# Altium project Bucaneve_single_board.PrjPcb
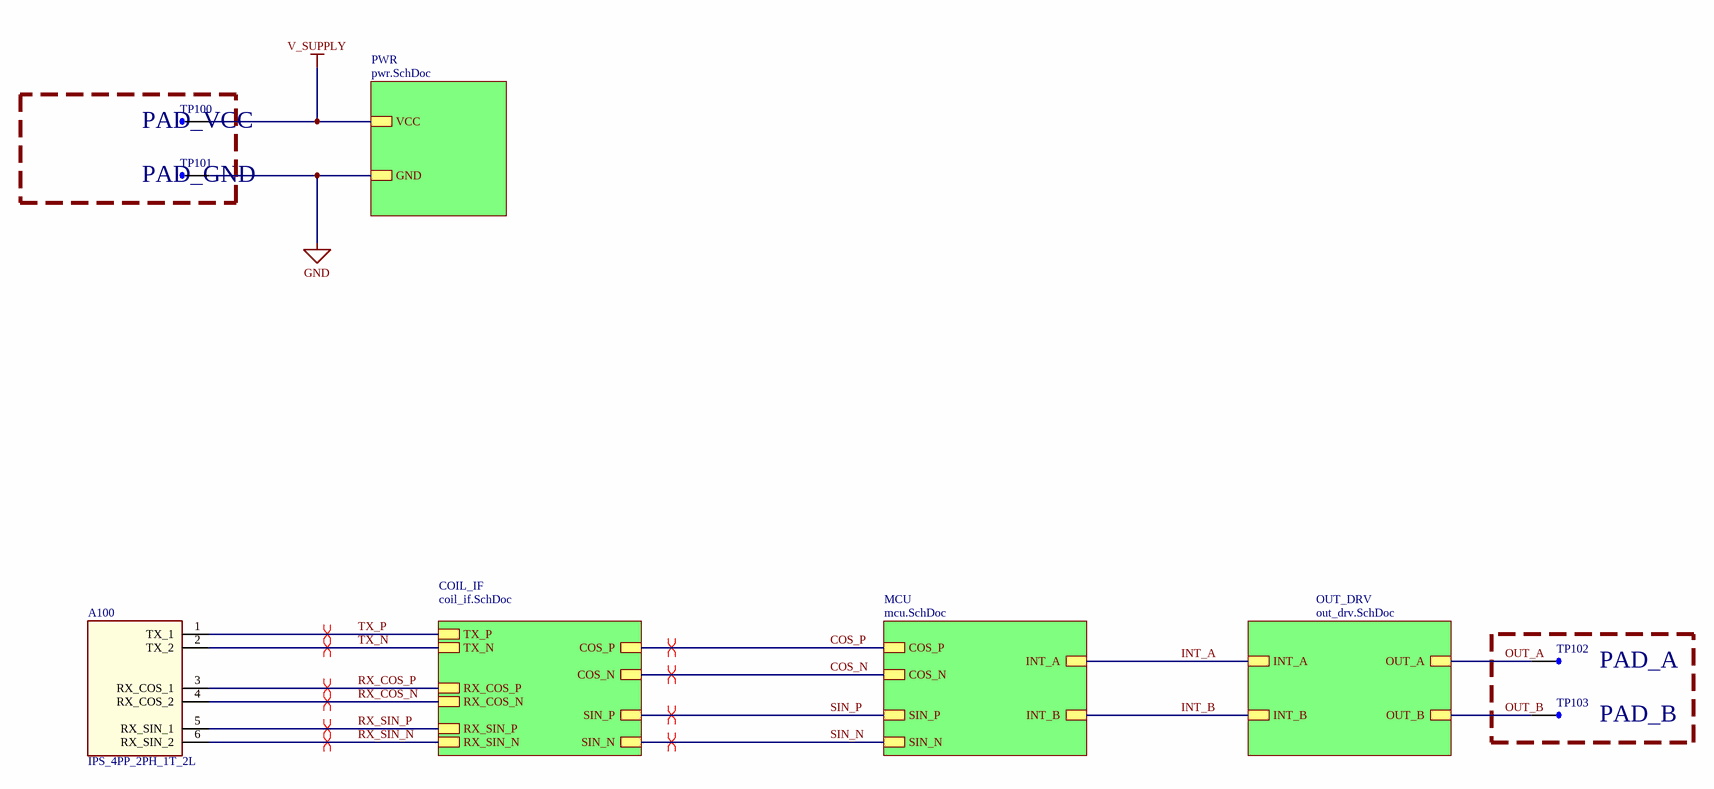
[diagram p0: Bucaneve_single_board.SchDoc]
ProjectRevisionDate: 30/09/2026; ProjectRevision: r0; ProjectCompany: PMP Pro-Mec; ProjectAuthor: S. Vesca; ProjectApproved: --- Not Approved yet ---
5 sheets, 84 parts. Net scope: hierarchical (ports join the sheet entries above them; power ports are global).
Board file: Bucaneve_single_board.PcbDoc
Sheets:
  Bucaneve_single_board.SchDoc
    PWR = pwr.SchDoc
    OUT_DRV = out_drv.SchDoc
    MCU = mcu.SchDoc
    COIL_IF = coil_if.SchDoc

## Sheet Bucaneve_single_board.SchDoc: =ProjectName+'_'+ProjectRevision+'_'+VariantName
size A3; Date: 30/09/2026; ApprovedBy: --- Not Approved yet ---; Author: S. Vesca; CompanyName: PMP Pro-Mec; DocumentNumber: 1; Revision: r0; SheetNumber: 1; SheetTotal: 5

### Parts
A100  IPS_4PP_2PH_1T_2L  [IPS_4PP_2PH_2T_2L4_4TX045_EXT]
TP100  Test Point  [TSTPNT_SMD_RECT_2x6]  (value not drawn)  (no BOM)
TP101  Test Point  [TSTPNT_SMD_RECT_2x6]  (value not drawn)  (no BOM)
TP102  Test Point  [TSTPNT_SMD_RECT_2x6]  (value not drawn)  (no BOM)
TP103  Test Point  [TSTPNT_SMD_RECT_2x6]  (value not drawn)  (no BOM)

### Sub-sheets
COIL_IF = coil_if.SchDoc: COS_P, COS_N, TX_P, TX_N, RX_COS_N, RX_COS_P, SIN_N, SIN_P, RX_SIN_P, RX_SIN_N
MCU = mcu.SchDoc: INT_A, INT_B, COS_P, COS_N, SIN_N, SIN_P
OUT_DRV = out_drv.SchDoc: OUT_A, OUT_B, INT_A, INT_B
PWR = pwr.SchDoc: GND, VCC

### Nets
GND: TP101.1 ; sheet PWR/GND
V_SUPPLY: TP100.1 ; sheet PWR/VCC
COS_N: sheet MCU/COS_N, sheet COIL_IF/COS_N  [project net COS_FILT_N]
COS_P: sheet MCU/COS_P, sheet COIL_IF/COS_P  [project net COS_FILT_P]
INT_A: sheet OUT_DRV/INT_A, sheet MCU/INT_A
INT_B: sheet OUT_DRV/INT_B, sheet MCU/INT_B
OUT_A: TP102.1 ; sheet OUT_DRV/OUT_A
OUT_B: TP103.1 ; sheet OUT_DRV/OUT_B
RX_COS_N: A100.4(RX_COS_2) ; sheet COIL_IF/RX_COS_N
RX_COS_P: A100.3(RX_COS_1) ; sheet COIL_IF/RX_COS_P
RX_SIN_N: A100.6(RX_SIN_2) ; sheet COIL_IF/RX_SIN_N
RX_SIN_P: A100.5(RX_SIN_1) ; sheet COIL_IF/RX_SIN_P
SIN_N: sheet MCU/SIN_N, sheet COIL_IF/SIN_N  [project net SIN_FILT_N]
SIN_P: sheet MCU/SIN_P, sheet COIL_IF/SIN_P  [project net SIN_FILT_P]
TX_N: A100.2(TX_2) ; sheet COIL_IF/TX_N
TX_P: A100.1(TX_1) ; sheet COIL_IF/TX_P

### Layout directives
differential pair: COS_FILT_N, COS_FILT_P, RX_COS_N, RX_COS_P, RX_SIN_N, RX_SIN_P, SIN_FILT_N, SIN_FILT_P, TX_N, TX_P

### Notes on the sheet
- PAD_VCC
- PAD_GND
- PAD_A
- PAD_B
- Proj
- Title:
- Approved:
- Sheet
- File Name:
- Rev:
- Author:
- Date:
- Size:
- A3
- Number:

### Library data of the parts
A100 = IPS_4PP_2PH_2T_2L4_4TX045_EXT: Inductive position sensor, 2 phase, 2 turn, 2Layers 4 Pole pairs; MFG1: PMP; Int Diameter: 39.5mm; Ext Diameter: 63mm; MPN1: IPS_4PP_2PH_2T_2L4_4TX045_EXT; Value: IPS_4PP_2PH_2T_2L
TP100-TP103 = TP_RECT_2x6: Test Point rect 2x5mm; ConnType: TestProbe; MPN1: TP_RECT_2x6; Value: TP_RECT_2x6; Pins: 1; Case/Package: SMD; Orientation: -; Mount: SMD

## Sheet pwr.SchDoc: =ProjectName+'_'+ProjectRevision+'_'+VariantName
size A3; Date: 30/09/2026; ApprovedBy: --- Not Approved yet ---; Author: S. Vesca; CompanyName: PMP Pro-Mec; DocumentNumber: 2; Revision: r0; SheetNumber: 2; SheetTotal: 5
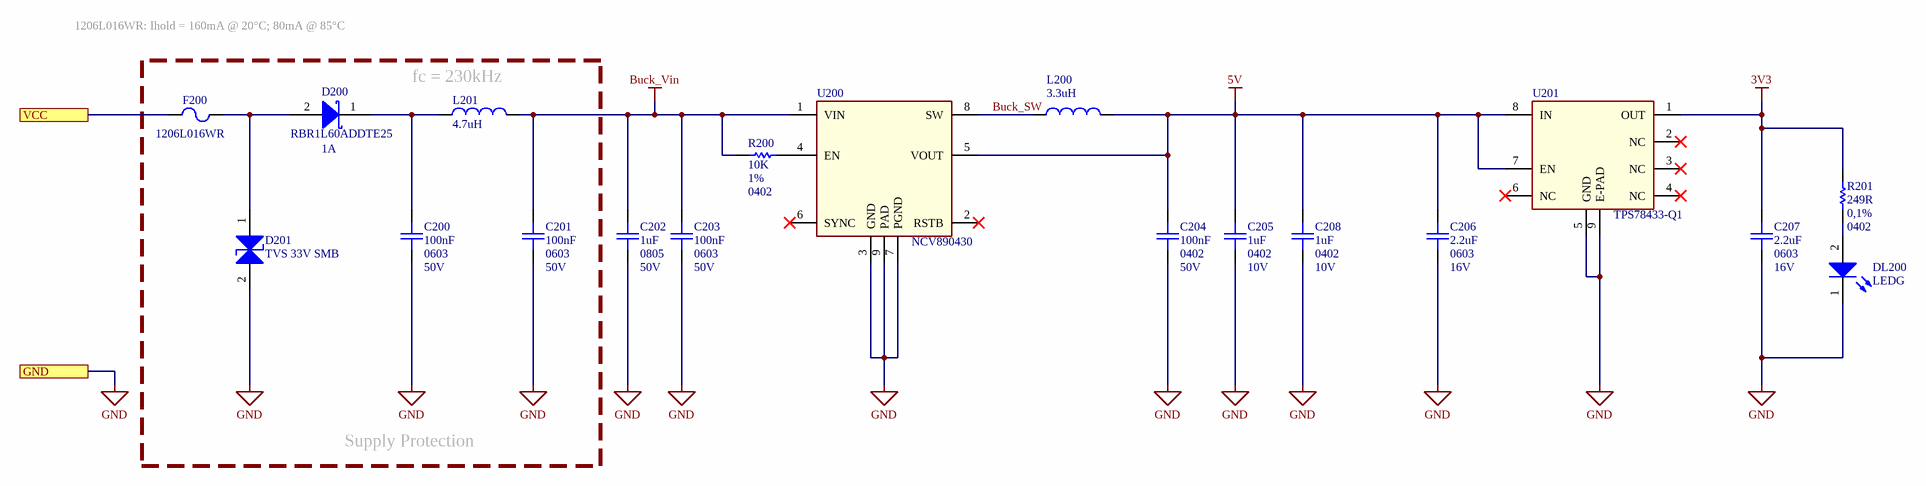
[diagram p1: pwr.SchDoc]

### Parts
C200  Case/Package: 0603  Op Voltage: 50V  [CER0603]  (hidden comment: 100nF)
C201  Case/Package: 0603  Op Voltage: 50V  [CER0603]  (hidden comment: 100nF)
C202  Case/Package: 0805  Op Voltage: 50V  [CER0805]  (hidden comment: 1uF)
C203  Case/Package: 0603  Op Voltage: 50V  [CER0603]  (hidden comment: 100nF)
C204  Case/Package: 0402  Op Voltage: 50V  [CER0402]  (hidden comment: 100nF)
C205  Case/Package: 0402  Op Voltage: 10V  [CER0402]  (hidden comment: 1uF)
C206  Case/Package: 0603  Op Voltage: 16V  [CER0603]  (hidden comment: 2.2uF)
C207  Case/Package: 0603  Op Voltage: 16V  [CER0603]  (hidden comment: 2.2uF)
C208  Case/Package: 0402  Op Voltage: 10V  [CER0402]  (hidden comment: 1uF)
D200  value RBR1L60ADDTE25  If (A): 1A  [DO-214AC_SMA]  (hidden comment: Shottky Rect Diode SMD)
D201  value TVS 33V SMB  [DO-214AA_SMB]  (hidden comment: SMD/PTH TVS Bidirectional Diode)
DL200  value LEDG  [LED SMD 0603]  (hidden comment: Single Color SMD LED)
F200  value 1206L016WR  [FUSC3216X125N]  (hidden comment: Fuse_PTCRes)
L200  value 3.3uH  [WE-MAPI_1212]  (hidden comment: SMD Inductor)
L201  value 4.7uH  [WE-LQ_1210]  (hidden comment: SMD Inductor)
R200  value 10K  Tolerance: 1%  Case/Package: 0402  [Res0402]  (hidden comment: SMD Resistor)
R201  value 249R  Tolerance: 0,1%  Case/Package: 0402  [Res0402]  (hidden comment: SMD Resistor)
U200  value NCV890430  [SON65P300X300X100-9N]  (hidden comment: ONSEMI_NCV890430)
U201  value TPS78433-Q1  [SON65P300X100_HS-9N_NOPAD]  (hidden comment: TI_TPS78533Q_VSON)

### Ports
GND, VCC

### Nets
3V3: C207.1 R201.2 U201.1(OUT)
5V: C204.1 C205.1 C206.1 C208.1 L200.2 U200.5(VOUT) U201.7(EN) U201.8(IN)
Buck_Vin: C201.1 C202.1 C203.1 L201.2 R200.2 U200.1(VIN)
GND: C200.2 C201.2 C202.2 C203.2 C204.2 C205.2 C206.2 C207.2 C208.2 D201.2(K) DL200.1(K) U200.3(GND) U200.7(PGND) U200.9(PAD) U201.5(GND) U201.9(E-PAD) ; port GND
V_SUPPLY: F200.1 ; port VCC
Buck_SW: L200.1 U200.8(SW)
NetC200_1: C200.1 D200.1(K) L201.1
NetD200_2: D200.2(A) D201.1(A) F200.2
NetDL200_2: DL200.2(A) R201.1
NetR200_1: R200.1 U200.4(EN)

Not connected (* = marked no-connect by the designer): U200 2(RSTB)* 6(SYNC)*; U201 2(NC)* 3(NC)* 4(NC)* 6(NC)*

### Notes on the sheet
- 1206L016WR: Ihold = 160mA @ 20°C; 80mA @ 85°C
- (near L201) fc = 230kHz
- Supply Protection
- Proj
- Title:
- Approved:
- Sheet
- File Name:
- Rev:
- Author:
- Date:
- Size:
- A3
- Number:

### Library data of the parts
C200 C201 C203 = GCM188L81H104KA57D: MLCC Automotive, 100nF, 0603, 50V, 10%, X8L; MFG1: MURATA; Min Op# Temp °C: -55; Max Op# temp °C: 150; Qualification: AEC-Q200; MPN1: GCM188L81H104KA57D; Value: 100nF; MFG2: MURATA; MPN2: GCJ188L8EL104KA07; Tolerance: 10%; Dielectric: X8L; Supplier: Mouser; Supplier Part Number: 81-GCM188L81H104KA7D; Supplier URL: https://www.mouser.it/ProductDetail/Murata-Electronics/GCM188L81H104KA57J?qs=yTuLhIm%2Fv1CdnQNNqnCjYQ%3D%3D; Datasheet URL: https://www.mouser.it/datasheet/2/281/1/GCM188L81H104KA57_01A-3144042.pdf; Termination: Soft (GCJ); Technology: Powertrain/Safety for Automotive
C202 = KAM21KR71H105KL: MLCC Automotive, 1uF, 0805, 50V, 10%, X7R; MFG1: KYOCERA-AVX; Min Op# Temp °C: -55; Max Op# temp °C: 125; Qualification: AEC-Q200; MPN1: KAM21KR71H105KL; Value: 1uF; Tolerance: 10%; Dielectric: X7R; Supplier: Mouser; Supplier Part Number: 581-KAM21KR71H105KL; Supplier URL: https://www.mouser.it/ProductDetail/KYOCERA-AVX/08055C105K4T4A?qs=byeeYqUIh0Oh891bMlItEA%3D%3D; Datasheet URL: https://www.mouser.it/datasheet/2/40/AutoMLCC-2952695.pdf; Technology: Powertrain/Safety for Automotive
C204 = GCM155R71H104KE02D: MLCC Automotive, 100nF, 0402, 50V, 10%, X7r; MFG1: MURATA; Min Op# Temp °C: -55; Max Op# temp °C: 125; Qualification: AEC-Q200; MPN1: GCM155R71H104KE02D; Value: 100nF; MFG2: MURATA; MPN2: GCM155R71H104KE37; Tolerance: 10%; Dielectric: X7R; Supplier: Mouser; Supplier Part Number: 81-GCM155R71H104KE2D; Supplier URL: https://www.mouser.it/ProductDetail/Murata-Electronics/GCM155R71H104KE02D?qs=hNud%2FORuBR2sLZsqfoz4Fw%3D%3D; Datasheet URL: https://www.mouser.it/datasheet/2/281/1/GCM155R71H104KE02_01A-3142168.pdf; Technology: Powertrain/Safety for Automotive
C205 C208 = GCM155C71A105ME38D: MLCC Automotive, 1uF, 0402, 10V, 20%, X7S; MFG1: MURATA; Tolerance: 20.00%; Min Op# Temp °C: -55; Max Op# temp °C: 125; Qualification: AEC-Q200; MPN1: GCM155C71A105ME38D; Value: 1uF; Dielectric: X7S; Supplier: Mouser; Supplier Part Number: 81-GCM155C71A105ME8D; Supplier URL: https://www.mouser.it/it/ProductDetail/Murata-Electronics/GCM155C71A105ME38D?qs=sGAEpiMZZMvsSlwiRhF8qiE2qjJvMbsZOkfRw1uqIZmZq%252BZnnVO3gA%3D%3D; Datasheet URL: https://pim.murata.com/asset/pim4/ceramicCapacitorSMD/GCM155C71A105ME38-01A-EN_PDF_CERAMICCAPACITORSMD
C206 C207 = GRT188C71C225KE13D: MLCC Automotive, 2.2uF, 0603, 16V, 10%, X7S; MFG1: MURATA; Min Op# Temp °C: -55; Max Op# temp °C: 125; Qualification: AEC-Q200; MPN1: GRT188C71C225KE13D; Value: 2.2uF; Tolerance: 10%; Dielectric: X7S; Supplier: Mouser; Supplier Part Number: 81-GRT188C71C225KE3D; Supplier URL: https://www.mouser.it/it/ProductDetail/Murata-Electronics/GRT188C71C225KE13D?qs=hd1VzrDQEGhlNcWcmqnE6Q%3D%3D; Datasheet URL: https://www.mouser.it/datasheet/3/76/1/GRT188C71C225KE13_01A.pdf
D200 = RBR1L60ADDTE25: Schottky Rectifier Diode 1A 60V SMA; MFG1: ROHM; Min Op# Temp °C: -55; Max Op# temp °C: 150; Qualification: AEC-Q101; MPN1: RBR1L60ADDTE25; Vreverse: 60V; Case/Package: SMA(DO-214AC); Supplier: Mouser; Supplier Part Number: 755-RBR1L60ADDTE25; Supplier URL: https://www.mouser.it/it/ProductDetail/ROHM-Semiconductor/RBR1L60ADDTE25?qs=4v%252BiZTmLVHHPf04ac7QKmA%3D%3D; Datasheet URL: https://www.rohm.com/datasheet?p=RBR1L60ADD&dist=Mouser&media=referral&source=mouser.com&campaign=Mouser
D201 = SM6T33CAY: TVS Bidir 33V SMB; MFG1: ST; 10/1000us Power: 0.6Kw; 8/20us Power: 4KW; Stand-Off Voltage: 28.2V; Min Op# Temp °C: -55; Max Op# temp °C: 150; Qualification: AEC-Q101; MPN1: SM6T33CAY; Case/Package: SMB/DO-214AA; Type: Bidirectional; Supplier: Mouser; Supplier Part Number: 511-SM6T33CAY; Supplier URL: https://www.mouser.it/ProductDetail/STMicroelectronics/SM6T33CAY?qs=94V4QatVK%252BdOInZlA3gJmA%3D%3D
DL200 = SML-D12P8WT86C: LED standard - SMD Grn 560nm 6.3mcd 2.2 V, 20mA, 0603 AECQ-102; MFG1: ROHM; Vf: 2V @4mA; Max Current@ Tmax: 4mA; Power Diss (mW): 54mW; Min Op# Temp °C: -40; Max Op# temp °C: 100; Qualification: AEC-Q101; MPN1: SML-D12P8WT86C; Case/Package: 0603-Top View; Color: Green 560nm; Supplier: Mouser; Supplier Part Number: 755-SML-D12P8WT86C; Supplier URL: https://www.mouser.it/ProductDetail/ROHM-Semiconductor/SML-D12P8WT86C?qs=HXFqYaX1Q2wFepzn1zWRrg%3D%3D; Datasheet URL: https://fscdn.rohm.com/en/products/databook/datasheet/opto/led/chip_mono/sml-d12p8wt86(c)-e.pdf; Technology: SM
F200 = 1206L016WR: Resettable Fuse PPTC, 160mA Hold, 370mA Trip, 4.5R min, 30V; MFG1: LITTLEFUSE; Max Resistance: 4.5; Min Op# Temp °C: -40; Max Op# temp °C: 125°; Manufacturer: *; PN: *; Voltage: *; Current: *; MPN1: 1206L016WR; Hold Current: 160mA; Case/Package: 1206; Trip Current: 370mA; Supplier: Mouser; Supplier Part Number: 576-1206L016WR; Supplier URL: https://www.mouser.it/it/ProductDetail/Littelfuse/1206L016WR?qs=PWhpLWeW8weybSDHdny44Q%3D%3D; Datasheet URL: https://www.littelfuse.com/assetdocs/resettable-ptcs-1206l-datasheet?assetguid=2B6A1515-D4EE-4C83-8BD4-152B4901B8F5; Technology: SMD
L200 = 74438333033: Power Inductors - SMD WE-MAPI 3,3uH 1.1A DCR=266mOhms AECQ200; MFG1: WE; Fres (MHz): 38; Rated Current (mA): 1.85; Sat Current (mA): 2.05; Rated Voltage: 80; Min Op# Temp °C: -40; Max Op# temp °C: 125; Qualification: AEC-Q200; MPN1: 74438333033; DCR (mR): 266mOhm; Case/Package: 1212; Supplier: Mouser; Supplier Part Number: 710-74438333033; Supplier URL: https://www.mouser.it/it/ProductDetail/Wurth-Elektronik/74438333033?qs=ZB8tH5z5N7YH5nN%252BUBdrEg%3D%3D; Datasheet URL: https://www.we-online.com/components/products/datasheet/74438333033.pdf; Technology: SMD
L201 = 744032004: EMI Filtering Inductor WE-LQ SMT, 4.7uH, 490mA,; MFG1: WE; Rated Current (mA): 490; Sat Current (mA): 1250; DCR (mR): 280mOhm; Min Op# Temp °C: -40; Max Op# temp °C: 125; MPN1: 744032004; Case/Package: 1210; Supplier: Mouser; Supplier Part Number: 710-744032004; Supplier URL: https://www.mouser.it/it/ProductDetail/Wurth-Elektronik/744032004?qs=XJfXErqHgA4qekdNbV2MtQ%3D%3D; Datasheet URL: https://www.we-online.com/components/products/datasheet/744032004.pdf; Technology: SMD
R200 = CRCW040210K0FKED: Thick Film SM Chip Resistors, 10K, 0402, ±1%, 1/10W; MFG1: VISHAY; Power: 63mW; Temp# Coeffiient (PPM/C): 100; Min Op# Temp °C: -55; Max Op# temp °C: 155; Qualification: AEC-Q200; MPN1: CRCW040210K0FKED; Supplier: Mouser; Supplier Part Number: 71-CRCW0402-10K-E3; Supplier URL: https://www.mouser.it/ProductDetail/Vishay-Dale/CRCW040210K0FKED?qs=rlE3Te1NifyN3e8vvxacSw%3D%3D; Technology: Thick Film
R201 = TNPW0402249RBYEP: Thick Film SM Chip Resistors, 249R, 0402, ±0.1%, 10ppm 1/16W; MFG1: VISHAY; Power: 63mW; Temp# Coeffiient (PPM/C): 10; Min Op# Temp °C: -55; Max Op# temp °C: 155; Qualification: AEC-Q200; MPN1: TNPW0402249RBYEP; Supplier: Mouser; Supplier Part Number: 71-TNPW0402249RBYEP; Supplier URL: https://www.mouser.it/ProductDetail/Vishay-Dale/TNPW0402249RBYEP?qs=iLbezkQI%252Bsgmf6IA3nvojA%3D%3D; Technology: Thick Film
U200 = NCV890430MW50TXG: synchronous buck converter; 3.5-37Vin; 5Vout; 600mA; MFG1: OnSemi; Frequency: 2MHz / 1MHz; Max Duty Cycle: 1; Max Input Voltage: 37V; Min Supply Voltage: 3.5V; Min Op# Temp °C: -40°C; Max Op# temp °C: 150°C; Nominal Output Voltage: 5V; Qualification: AEC-Q100; MPN1: NCV890430MW50TXG; Case/Package: DFN-8; Op Voltage: 3.5-37V; Supplier: Mouser; Supplier Part Number: 863-NCV890430MW50TXG; Supplier URL: https://www.mouser.it/it/ProductDetail/onsemi/NCV890430MW50TXG?qs=OycAS1CGnlh8h8gdwAjytg%3D%3D; Datasheet URL: https://www.onsemi.com/download/data-sheet/pdf/ncv890430-d.pdf; ComponentType: DCDC converter; Max Ouput Current: 600mA; Max Supply Voltage (DC): 37V; Min Input Voltage: 3.5V; Switching Frequency: 2MHz / 1MHz
U201 = TPS78433QWDRBRQ1: TPS784-Q1 Automotive, 3.3V, 300mA, High-PSRR LDO; MFG1: TI; Vin Min (V): 1.7; Vin Max (V): 6V; Out Voltage Accuracy: 0.5%; Dropout @ Imax (V): 0.08; Quiescent cuttent(uA): 25; Min Op# Temp °C: -40; Max Op# temp °C: 150; Qualification: AEC-Q100; MPN1: TPS78433QWDRBRQ1; Case/Package: WSON-8 3x3; Imax (mA): 300mA; Output Type: 3.3V; Supplier: Mouser; Supplier Part Number: 595-TPS78433QWDRBRQ1; Supplier URL: https://www.mouser.it/ProductDetail/Texas-Instruments/TPS78433QWDRBRQ1?qs=iLbezkQI%252BsgJRXPFYNHjvQ%3D%3D; Datasheet URL: https://www.ti.com/lit/gpn/tps784-q1

## Sheet out_drv.SchDoc: =ProjectName+'_'+ProjectRevision+'_'+VariantName
size A3; Date: 30/09/2026; ApprovedBy: --- Not Approved yet ---; Author: S. Vesca; CompanyName: PMP Pro-Mec; DocumentNumber: 5; Revision: r0; SheetNumber: 5; SheetTotal: 5
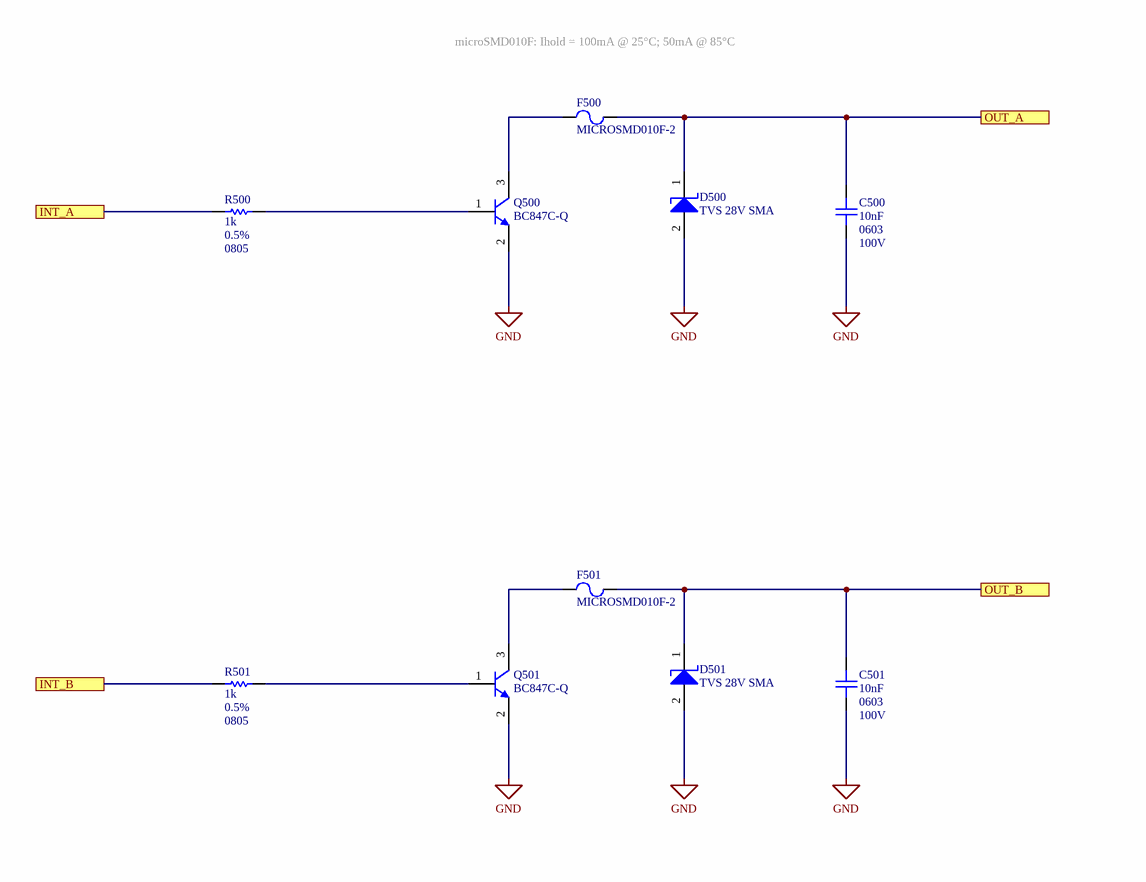
[diagram p2: out_drv.SchDoc, left]

### Parts
C500  Case/Package: 0603  Op Voltage: 100V  [CER0603]  (hidden comment: 10nF)
C501  Case/Package: 0603  Op Voltage: 100V  [CER0603]  (hidden comment: 10nF)
D500  value TVS 28V SMA  [DO-214AC_SMA]  (hidden comment: SMD/PTH TVS Unidirectional Diode)
D501  value TVS 28V SMA  [DO-214AC_SMA]  (hidden comment: SMD/PTH TVS Unidirectional Diode)
F500  value MICROSMD010F-2  [PTCC3226X08N]  (hidden comment: Fuse_PTCRes)
F501  value MICROSMD010F-2  [PTCC3226X08N]  (hidden comment: Fuse_PTCRes)
Q500  value BC847C-Q  [SOT95P230X110-3N]  (hidden comment: NPN Transistor SMD)
Q501  value BC847C-Q  [SOT95P230X110-3N]  (hidden comment: NPN Transistor SMD)
R500  value 1k  Tolerance: 0.5%  Case/Package: 0805  [Res0603]  (hidden comment: SMD Resistor)
R501  value 1k  Tolerance: 0.5%  Case/Package: 0805  [Res0603]  (hidden comment: SMD Resistor)

### Ports
INT_A, INT_B, OUT_A, OUT_B

### Nets
GND: C500.2 C501.2 D500.2(A) D501.2(A) Q500.2(E) Q501.2(E)
INT_A: R500.1 ; port INT_A
INT_B: R501.1 ; port INT_B
OUT_A: C500.1 D500.1(K) F500.2 ; port OUT_A
OUT_B: C501.1 D501.1(K) F501.2 ; port OUT_B
NetF500_1: F500.1 Q500.3(C)
NetF501_1: F501.1 Q501.3(C)
NetQ500_1: Q500.1(B) R500.2
NetQ501_1: Q501.1(B) R501.2

### Notes on the sheet
- microSMD010F: Ihold = 100mA @ 25°C; 50mA @ 85°C
- Proj
- Title:
- Approved:
- Sheet
- File Name:
- Rev:
- Author:
- Date:
- Size:
- A3
- Number:

### Library data of the parts
C500 C501 = GCM188R72A103KA37: MLCC Automotive, 10nF, 0603, 100V, 10%, X7R; MFG1: MURATA; Min Op# Temp °C: -55; Max Op# temp °C: 125; Qualification: AEC-Q200; MPN1: GCM188R72A103KA37; Value: 10nF; Tolerance: 10%; Dielectric: X7R; Supplier: Mouser; Supplier Part Number: 81-GCM188R72A103KA7D; Supplier URL: https://www.mouser.it/ProductDetail/Murata-Electronics/GCM188R72A103KA37D?qs=aEuGZpxfbxXMjTExujWHsg%3D%3D; Datasheet URL: https://www.mouser.it/datasheet/2/281/1/GCM188R72A103KA37_01C-3144519.pdf; Technology: Powertrain/Safety for Automotive
D500 D501 = SMA6T28AY: TVS Uniir 28V SMA; MFG1: ST; 10/1000us Power: 0.6Kw; 8/20us Power: 4KW; Stand-Off Voltage: 24V; Min Op# Temp °C: -55; Max Op# temp °C: 150; Qualification: AEC-Q101; MPN1: SMA6T28AY; Case/Package: SMA/DO-214AC; Type: Unidirectional; Supplier: Mouser; Supplier Part Number: 511-SMA6T28AY; Supplier URL: https://www.mouser.it/ProductDetail/STMicroelectronics/SMAJ30A-TR?qs=zr%2F4QzOm779pW41kykOibw%3D%3D; Datasheet URL: https://www.mouser.it/datasheet/2/389/sma6ty-1850088.pdf
F500 F501 = MICROSMD010F-2: Resettable Fuse PPTC, 100mA Hold, 250mA Trip, 2.1R min, 30V; MFG1: LITTLEFUSE; Max Resistance: 2.1; Min Op# Temp °C: -40; Max Op# temp °C: 85°; Manufacturer: *; PN: *; Voltage: *; Current: *; MPN1: MICROSMD010F-2; Hold Current: 100mA; Case/Package: 1210; Trip Current: 250mA; Supplier: Mouser; Supplier Part Number: 650-MICROSMD010F-2; Supplier URL: https://www.mouser.it/it/ProductDetail/Littelfuse/MICROSMD010F-2?qs=RMiEzKrVl1c3GmCbTUJbRQ%3D%3D; Datasheet URL: https://www.littelfuse.com/assetdocs/littelfuse-ptc-microsmd-datasheet?assetguid=9831a125-bc6a-4727-872e-aa92d8395030; Technology: SMD
Q500 Q501 = NEXPERIA: NPN general purpose transistors; MPN1: BC847C-QR; Vce Max (V): 45; Ic (mA): 100; Hfe (min): 520; Power Diss (mW): 250; Min Op# Temp °C: -65; Max Op# temp °C: 150; Qualification: AEC-Q101; Manufacturer: *; PN: *; MFG1: NEXPERIA; MFG2: Diodes; MPN2: BC847C-Q; Case/Package: SOT23-3; Type: NPN; Supplier: Mouser; Supplier Part Number: 771-BC847C-QR; Supplier URL: https://www.mouser.it/ProductDetail/Nexperia/BC847C-QR?qs=e8oIoAS2J1RqA3Lgar2wrA%3D%3D; Manufacturer URL: https://www.nexperia.com/search?q=BC847C-Q&searchCategory=
R500 R501 = ERJ-UP6D1001V: Thick Film SM Chip Resistors, 1K, 0805, ±0.5%, 1/2W; MFG1: PANASONIC; Power: 500mW; Temp# Coeffiient (PPM/C): 100; Min Op# Temp °C: -55; Max Op# temp °C: 155; Qualification: AEC-Q200; MPN1: ERJ-UP6D1001V; Supplier: Mouser; Supplier Part Number: 667-ERJ-UP6D1001V; Supplier URL: https://www.mouser.it/ProductDetail/Panasonic/ERJ-UP6D1001V?qs=sGAEpiMZZMvdGkrng054t2cqbZCzJY7NErLgAwiDoTXwln0CjOTO8w%3D%3D; Datasheet URL: https://www.mouser.com/catalog/specsheets/Panasonic_03-31-2024_Resistor_Anti-Sulfur(ERJ-UP6D-Series).pdf?_gl=1*1e8nwi8*_gcl_aw*R0NMLjE3Njc5NTQ2NTkuQ2p3S0NBaUE2NExMQmhCaEVpd0EtUHhndXhkNEYtbVB4TUc1OThEMlhWWVZvVEZGVXVGM1djYmUtdlk1a3VMZFRfZGNHclBMelhFSjRSb0NH; Technology: Thick Film

## Sheet mcu.SchDoc: =ProjectName+'_'+ProjectRevision+'_'+VariantName
size A3; Date: 30/09/2026; ApprovedBy: --- Not Approved yet ---; Author: S. Vesca; CompanyName: PMP Pro-Mec; DocumentNumber: 4; Revision: r0; SheetNumber: 4; SheetTotal: 5
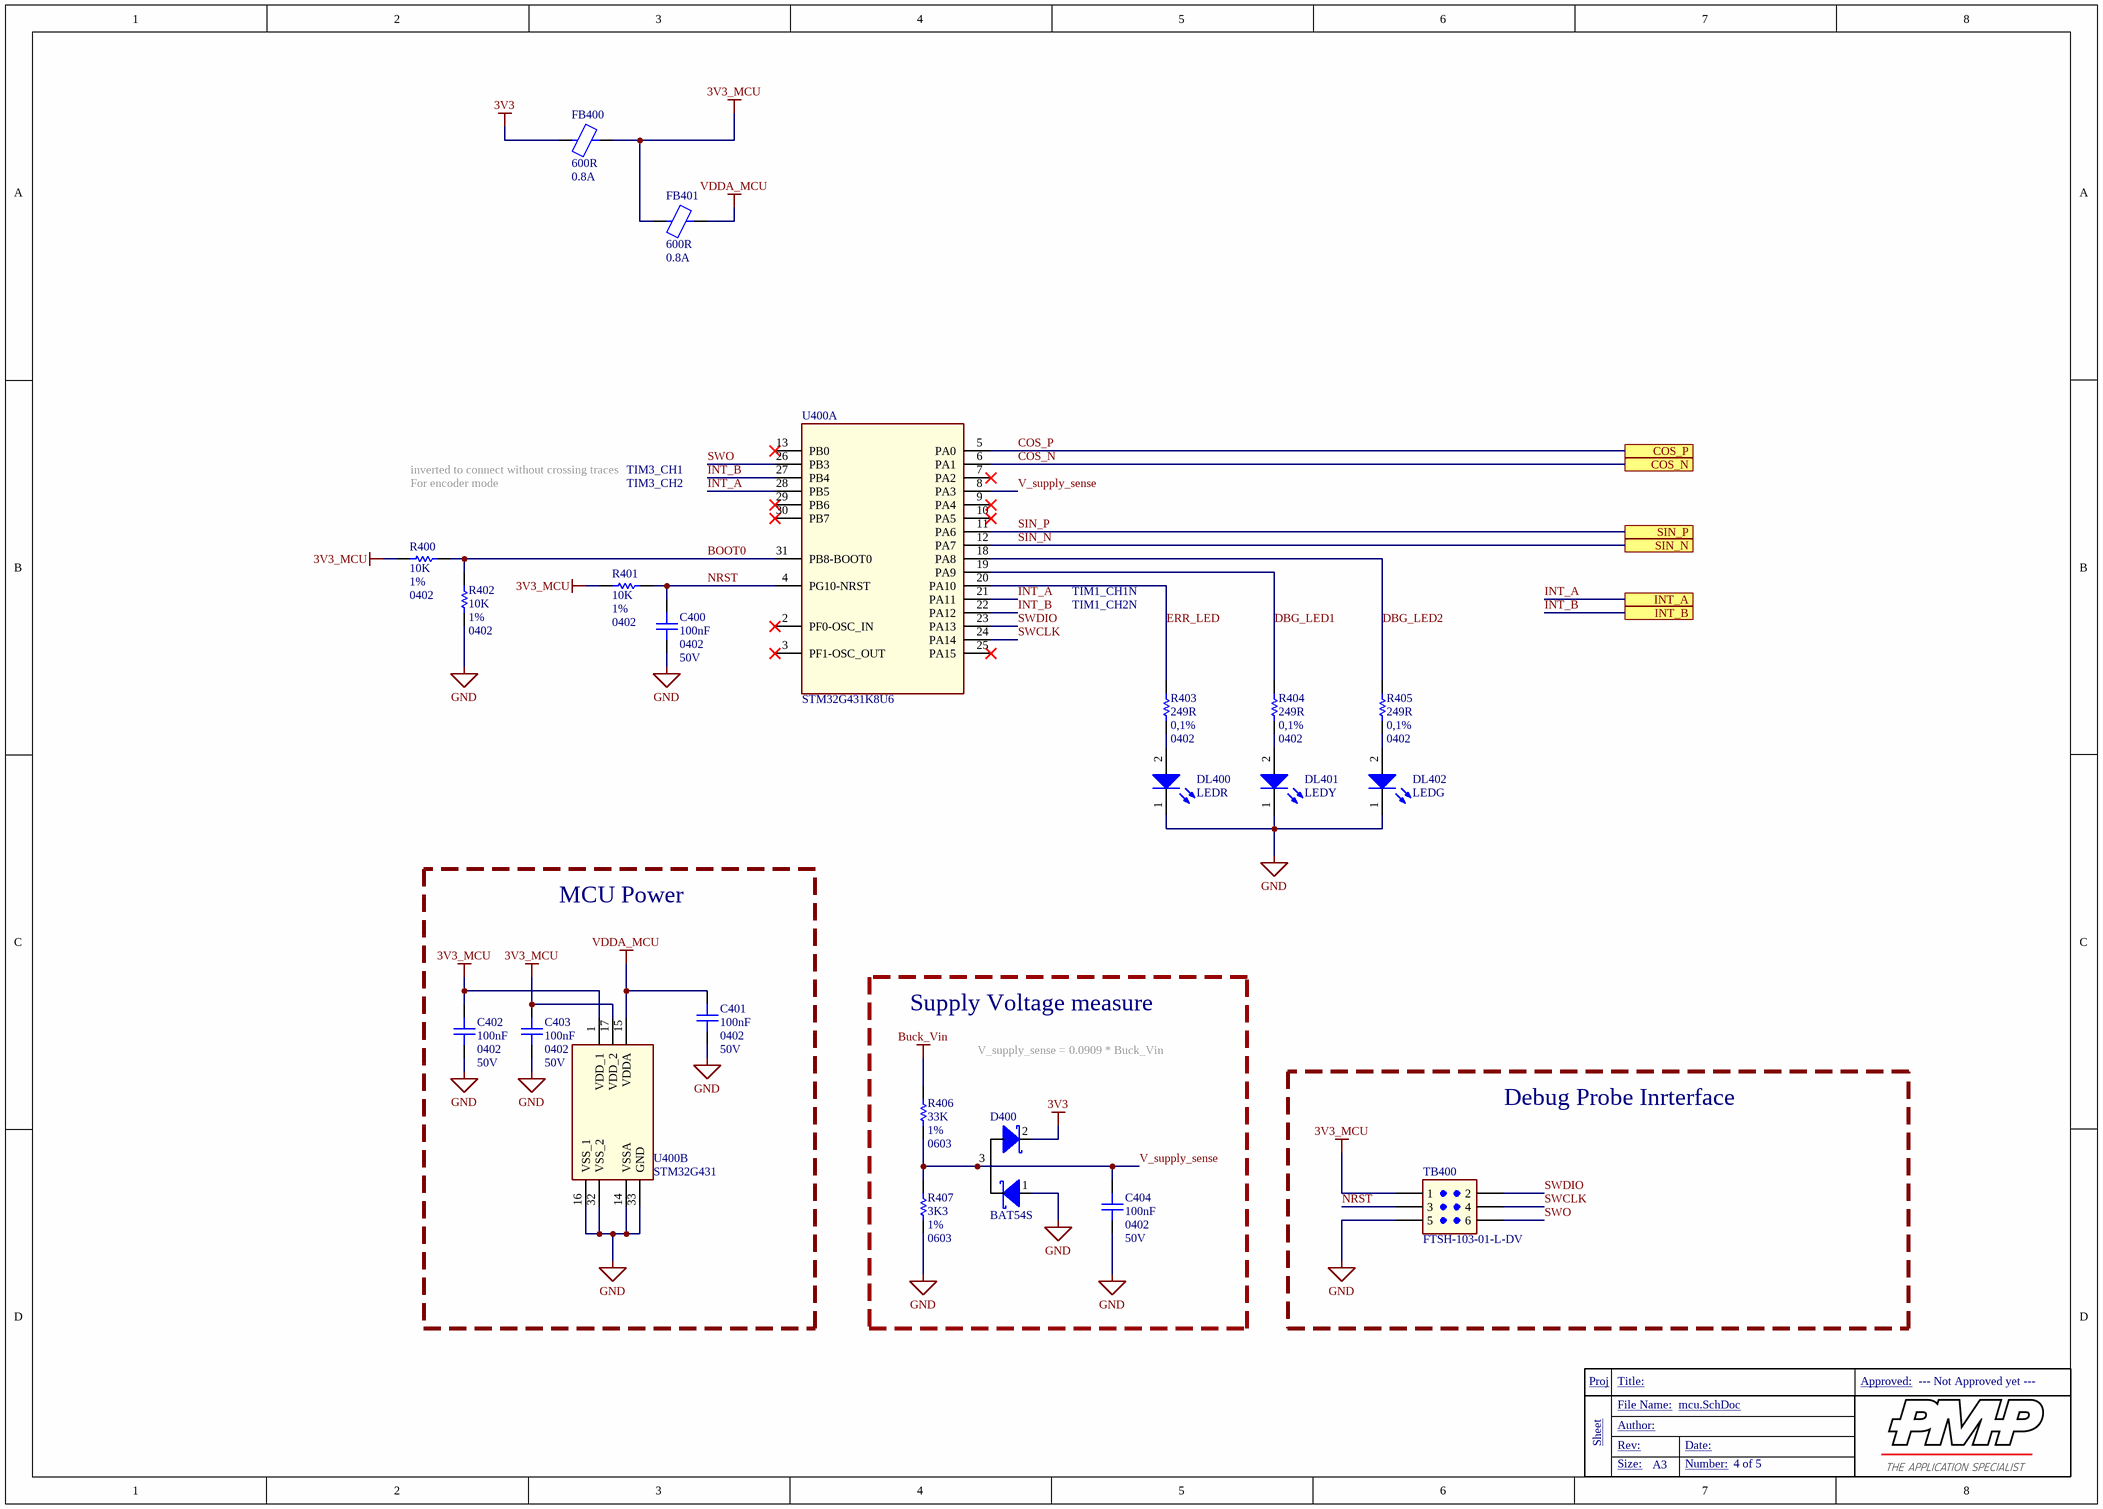
[diagram p3: mcu.SchDoc]

### Parts
C400  Case/Package: 0402  Op Voltage: 50V  [CER0402]  (hidden comment: 100nF)
C401  Case/Package: 0402  Op Voltage: 50V  [CER0402]  (hidden comment: 100nF)
C402  Case/Package: 0402  Op Voltage: 50V  [CER0402]  (hidden comment: 100nF)
C403  Case/Package: 0402  Op Voltage: 50V  [CER0402]  (hidden comment: 100nF)
C404  Case/Package: 0402  Op Voltage: 50V  [CER0402]  (hidden comment: 100nF)
D400  value BAT54S  [SOT95P230X110-3N]  (hidden comment: Double Schottky Diode, SOT23-3 series)
DL400  value LEDR  [LED SMD 0603]  (hidden comment: Single Color SMD LED)
DL401  value LEDY  [LED_PLCC-4]  (hidden comment: Single Color SMD LED)
DL402  value LEDG  [LED SMD 0603]  (hidden comment: Single Color SMD LED)
FB400  Impedence @100MHz: 600R  Rated Current @85°C: 0.8A  [FEB0603]
FB401  Impedence @100MHz: 600R  Rated Current @85°C: 0.8A  [FEB0603]
R400  value 10K  Tolerance: 1%  Case/Package: 0402  [Res0402]  (hidden comment: SMD Resistor)
R401  value 10K  Tolerance: 1%  Case/Package: 0402  [Res0402]  (hidden comment: SMD Resistor)
R402  value 10K  Tolerance: 1%  Case/Package: 0402  [Res0402]  (hidden comment: SMD Resistor)
R403  value 249R  Tolerance: 0,1%  Case/Package: 0402  [Res0402]  (hidden comment: SMD Resistor)
R404  value 249R  Tolerance: 0,1%  Case/Package: 0402  [Res0402]  (hidden comment: SMD Resistor)
R405  value 249R  Tolerance: 0,1%  Case/Package: 0402  [Res0402]  (hidden comment: SMD Resistor)
R406  value 33K  Tolerance: 1%  Case/Package: 0603  [Res0603]  (hidden comment: SMD Resistor)
R407  value 3K3  Tolerance: 1%  Case/Package: 0603  [Res0603]  (hidden comment: SMD Resistor)
TB400  value FTSH-103-01-L-DV  [SAMTEC_FTSH-103_3x2_SMD]  (hidden comment: TC2030_NL)
U400  STM32G431K8U6  [QFN50P500X500X60-NOPAD]  (parts A,B of 2)

### Blocks framed on the sheet
MCU Power: C401-C403 U400
Supply Voltage measure: C404 D400 R406 R407
Debug Probe Inrterface: TB400

### Ports
COS_N, COS_P, INT_A, INT_B, SIN_N, SIN_P

### Nets
3V3: D400.2(K2) FB400.1
3V3_MCU: C402.1 C403.1 FB400.2 FB401.1 R400.2 R401.2 TB400.1 U400.1(VDD_1) U400.17(VDD_2)
Buck_Vin: R406.2
GND: C400.2 C401.2 C402.2 C403.2 C404.2 D400.1(A1) DL400.1(K) DL401.1(K) DL402.1(K) R402.1 R407.1 TB400.5 U400.14(VSSA) U400.16(VSS_1) U400.32(VSS_2) U400.33(GND)
VDDA_MCU: C401.1 FB401.2 U400.15(VDDA)
BOOT0: R400.1 R402.2 U400.31(PB8-BOOT0)
COS_N: U400.6(PA1) ; port COS_N  [project net COS_FILT_N]
COS_P: U400.5(PA0) ; port COS_P  [project net COS_FILT_P]
DBG_LED1: R404.2 U400.19(PA9)
DBG_LED2: R405.2 U400.18(PA8)
ERR_LED: R403.2 U400.20(PA10)
INT_A: U400.21(PA11) U400.28(PB5) ; port INT_A
INT_B: U400.22(PA12) U400.27(PB4) ; port INT_B
NRST: C400.1 R401.1 TB400.3 U400.4(PG10-NRST)
SIN_N: U400.12(PA7) ; port SIN_N  [project net SIN_FILT_N]
SIN_P: U400.11(PA6) ; port SIN_P  [project net SIN_FILT_P]
SWCLK: TB400.4 U400.24(PA14)
SWDIO: TB400.2 U400.23(PA13)
SWO: TB400.6 U400.26(PB3)
V_supply_sense: C404.1 D400.3(C) R406.1 R407.2 U400.8(PA3)
NetDL400_2: DL400.2(A) R403.1
NetDL401_2: DL401.2(A) R404.1
NetDL402_2: DL402.2(A) R405.1

Not connected (* = marked no-connect by the designer): U400 2(PF0-OSC_IN)* 3(PF1-OSC_OUT)* 7(PA2)* 9(PA4)* 10(PA5)* 13(PB0)* 25(PA15)* 29(PB6)* 30(PB7)*

### Notes on the sheet
- inverted to connect without crossing traces
- For encoder mode
- TIM3_CH1
- TIM3_CH2
- TIM1_CH1N
- TIM1_CH2N
- V_supply_sense = 0.0909 * Buck_Vin
- Proj
- Title:
- Approved:
- Sheet
- File Name:
- Rev:
- Author:
- Date:
- Size:
- A3
- Number:

### Library data of the parts
C400-C404 = GCM155R71H104KE02D: as C204 on sheet pwr; MPN1: GCM155R71H104KE02D; Value: 100nF; MFG2: MURATA; MPN2: GCM155R71H104KE37; Tolerance: 10%; Dielectric: X7R; Supplier: Mouser; Supplier Part Number: 81-GCM155R71H104KE2D; Supplier URL: https://www.mouser.it/ProductDetail/Murata-Electronics/GCM155R71H104KE02D?qs=hNud%2FORuBR2sLZsqfoz4Fw%3D%3D; Datasheet URL: https://www.mouser.it/datasheet/2/281/1/GCM155R71H104KE02_01A-3142168.pdf; Technology: Powertrain/Safety for Automotive
D400 = BAT54S: Dual Schottky Diode,  Dual Series, SOT23, 0.2A, 30V; MFG1: NEXPERIA; If (A): 0.2; Type: Dual Series A1K2C; MPN1: BAT54S; MFG2: OnSemi; MPN2: BAT54SLT1G; Vreverse: 30V; Case/Package: SOT323-3 (SC70)
DL400 = SML-D12U8WT86C: LED standard - SMD Red 620nm 63mcd 2.2 V, 20mA, 0603 AECQ-102; MFG1: ROHM; Vf: 2V @4mA; Max Current@ Tmax: 4mA; Power Diss (mW): 54mW; Min Op# Temp °C: -40; Max Op# temp °C: 100; Qualification: AEC-Q101; MPN1: SML-D12U8WT86C; Case/Package: 0603-Top View; Color: red 620nm; Supplier: Mouser; Supplier Part Number: 755-SML-D12U8WT86C; Supplier URL: https://www.mouser.it/ProductDetail/ROHM-Semiconductor/SML-D12U8WT86C?qs=HXFqYaX1Q2wNcb%2FPJz96zg%3D%3D; Datasheet URL: https://fscdn.rohm.com/en/products/databook/datasheet/opto/led/chip_mono/sml-d12u8wt86(c)-e.pdf; Technology: SM
DL401 = LY E63F-EAGA-36-1-50-R33: LED monocolore Yellow Power TOPLED; MFG1: OSRAM; Vf: 1.85V@4mA; Max Current@ Tmax: 50mA; Min Op# Temp °C: -40; Max Op# temp °C: 100; Qualification: AEC-Q102; MPN1: LY E63F-EAGA-36-1-50-R33; Case/Package: PLCC4 3x3.4 h3.8mm; Color: Yellow 590nm; Supplier: Mouser; Supplier Part Number: 720-LYE63FA5935; Supplier URL: https://www.mouser.it/it/ProductDetail/ams-OSRAM/LY-E63F-EAGA-36-1?qs=vLWxofP3U2ym8HO6HoqADg%3D%3D; Datasheet URL: https://dammedia.osram.info/media/resource/hires/osram-dam-7071545/LY%20E63F_EN.pdf; Technology: SM
DL402 = SML-D12P8WT86C: as DL200 on sheet pwr; MPN1: SML-D12P8WT86C; Case/Package: 0603-Top View; Color: Green 560nm; Supplier: Mouser; Supplier Part Number: 755-SML-D12P8WT86C; Supplier URL: https://www.mouser.it/ProductDetail/ROHM-Semiconductor/SML-D12P8WT86C?qs=HXFqYaX1Q2wFepzn1zWRrg%3D%3D; Datasheet URL: https://fscdn.rohm.com/en/products/databook/datasheet/opto/led/chip_mono/sml-d12p8wt86(c)-e.pdf; Technology: SM
FB400 FB401 = BLM18HE601SH1D: SMD EMI Suppression Ferrite Bead 600R, 0603, For DC Power; MFG1: MURATA; Rated Current @125°C: 0.6A; DCR (mR): 125; Min Op# Temp °C: -55; MPN1: BLM18HE601SH1D; Impedence @1GHz: 600R; Case/Package: 0603; Supplier: Mouser; Supplier Part Number: 81-BLM18HE601SH1D; Supplier URL: https://www.mouser.it/ProductDetail/Murata-Electronics/BLM18HE601SH1D?qs=d0WKAl%252BL4KZJDOgHon8ecQ%3D%3D; Datasheet URL: https://www.murata.com/products/productdata/8796199452702/QNFA9104.pdf?1539737628000; Max Op# temp °C: 125; Technology: AEC-Q200
R400-R402 = CRCW040210K0FKED: as R200 on sheet pwr; MPN1: CRCW040210K0FKED; Supplier: Mouser; Supplier Part Number: 71-CRCW0402-10K-E3; Supplier URL: https://www.mouser.it/ProductDetail/Vishay-Dale/CRCW040210K0FKED?qs=rlE3Te1NifyN3e8vvxacSw%3D%3D; Technology: Thick Film
R403-R405 = TNPW0402249RBYEP: as R201 on sheet pwr; MPN1: TNPW0402249RBYEP; Supplier: Mouser; Supplier Part Number: 71-TNPW0402249RBYEP; Supplier URL: https://www.mouser.it/ProductDetail/Vishay-Dale/TNPW0402249RBYEP?qs=iLbezkQI%252Bsgmf6IA3nvojA%3D%3D; Technology: Thick Film
R406 = CRCW060333K0FKEA: Thick Film SM Chip Resistors, 33K, 0603, ±1%, 1/10W; MFG1: VISHAY; Power: 100mW; Temp# Coeffiient (PPM/C): 100; Min Op# Temp °C: -55; Max Op# temp °C: 155; Qualification: AEC-Q200; MPN1: CRCW060333K0FKEA; Supplier: Mouser; Supplier Part Number: 71-CRCW0603-33K-E3; Supplier URL: https://www.mouser.it/ProductDetail/Vishay-Dale/CRCW060333K0FKEA?qs=lRdAfIXKPc%2FlOd6gcmC8oQ%3D%3D; Technology: Thick Film
R407 = CRCW06033K30FKEA: Thick Film SM Chip Resistors, 3K3, 0603, ±1%, 1/10W; MFG1: VISHAY; Power: 100mW; Temp# Coeffiient (PPM/C): 100; Min Op# Temp °C: -55; Max Op# temp °C: 155; Qualification: AEC-Q200; MPN1: CRCW06033K30FKEA; Supplier: Mouser; Supplier Part Number: 71-CRCW0603-3.3K-E3; Supplier URL: https://www.mouser.it/ProductDetail/Vishay-Dale/CRCW06033K30FKEA?qs=1ghF3ZI8kS8fRqapjAj84Q%3D%3D&gad_source=1&gclid=EAIaIQobChMI4J_M0IWohAMVrUNBAh1qNACkEAAYBCAAEgIV-vD_BwE; Technology: Thick Film
TB400 = FTSH-103-01-L-DV: Samtech FTSH Header, 6pin (3x2), pitch 1.27mm, for Arm Jtag; MFG1: Samtec; Pitch: 1.27; Min Op# Temp °C: -55; Max Op# temp °C: 125; MPN1: FTSH-103-01-L-DV; Pins: 6; Case/Package: SMD-6; Orientation: Vertical; Mount: SMD; Supplier: Mouser; Supplier Part Number: 200-FTSH10301LDV; Supplier URL: https://www.mouser.it/it/ProductDetail/Samtec/FTSH-103-01-L-DV?qs=WqbWUrltBn0517uOVN%2FZKw%3D%3D; Datasheet URL: https://www.mouser.it/datasheet/3/85/1/ftsh_smt.pdf
U400 = STM32G431K8U6: MCU  Arm Cortex-M4 MCU 170 MHz -64 KB Flash; Manufacturer_Name: STMicroelectronics; Geometry.Height: 0.6mm; Mouser Part Number: 511-STM32G431K8U6; Mouser Price/Stock: https://www.mouser.co.uk/ProductDetail/STMicroelectronics/STM32G431K8U6?qs=sPbYRqrBIVmxpguskjGNNg%3D%3D; Manufacturer_Part_Number: STM32G431K8U6; Datasheet Link: https://www.st.com/resource/en/datasheet/stm32g431c6.pdf; MPN1: STM32G431K8U6; Value: STM32G431; MFG1: STMicroelectronics; Case/Package: QFN32

## Sheet coil_if.SchDoc: =ProjectName+'_'+ProjectRevision+'_'+VariantName
size A3; Date: 30/09/2026; ApprovedBy: --- Not Approved yet ---; Author: S. Vesca; CompanyName: PMP Pro-Mec; DocumentNumber: 3; Revision: r0; SheetNumber: 3; SheetTotal: 5
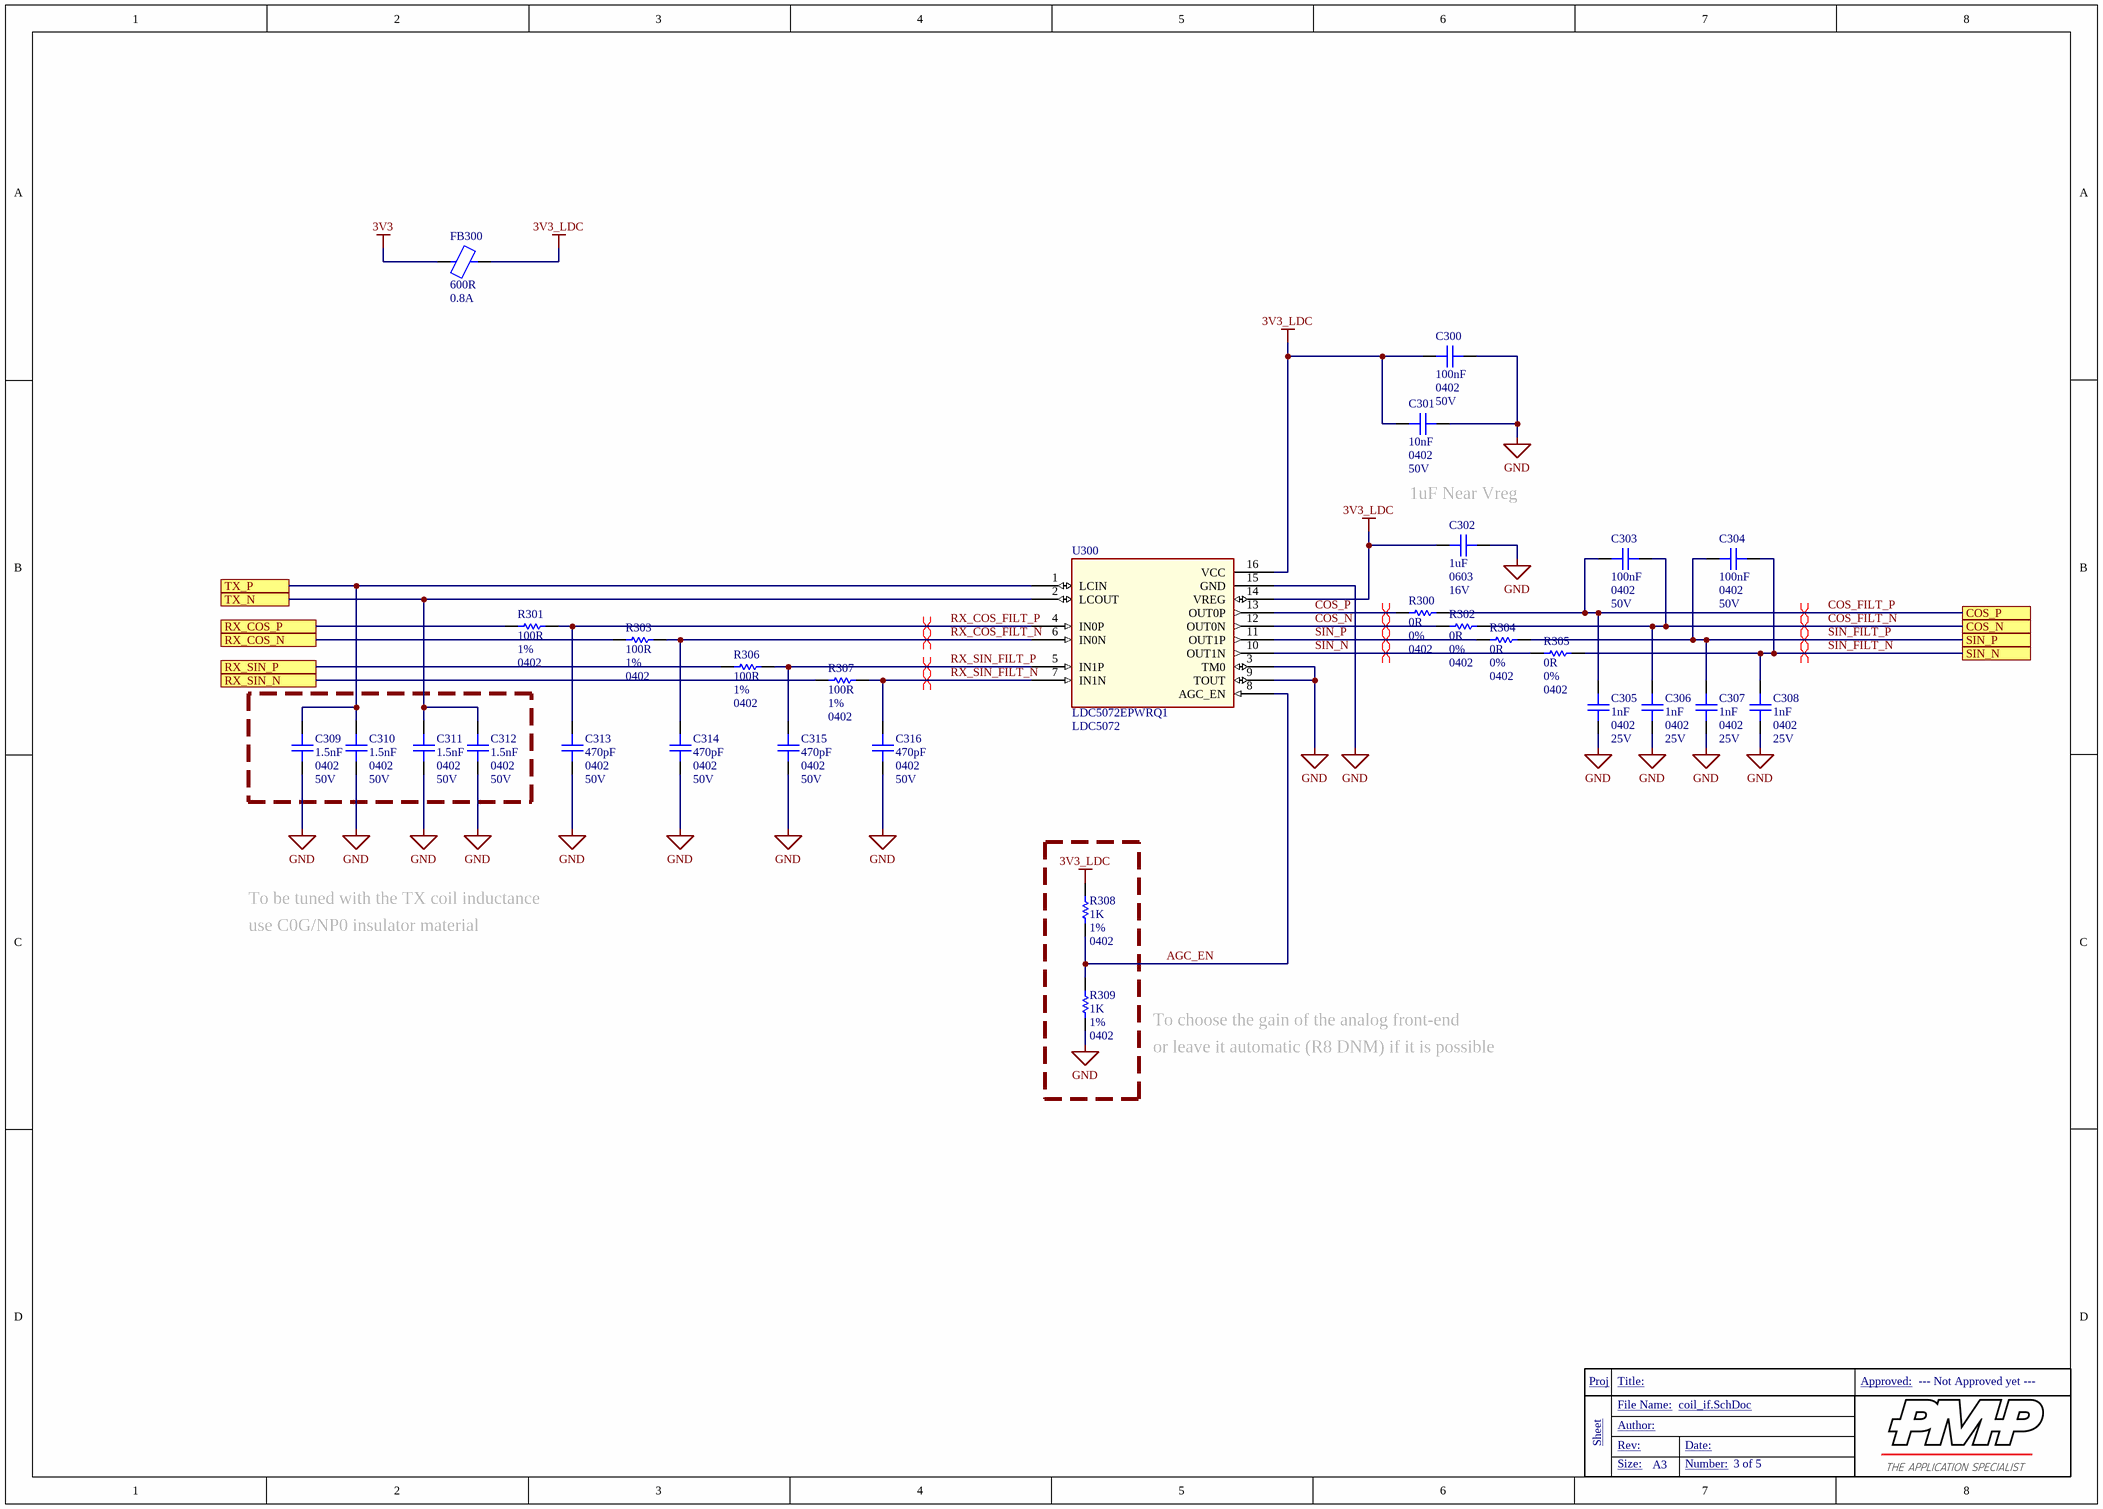
[diagram p4: coil_if.SchDoc]

### Parts
C300  Case/Package: 0402  Op Voltage: 50V  [CER0402]  (hidden comment: 100nF)
C301  Case/Package: 0402  Op Voltage: 50V  [CER0402]  (hidden comment: 10nF)
C302  Case/Package: 0603  Op Voltage: 16V  [CER0603]  (hidden comment: 1uF)
C303  Case/Package: 0402  Op Voltage: 50V  [CER0402]  (hidden comment: 100nF)
C304  Case/Package: 0402  Op Voltage: 50V  [CER0402]  (hidden comment: 100nF)
C305  Case/Package: 0402  Op Voltage: 25V  [CER0402]  (hidden comment: 1nF)
C306  Case/Package: 0402  Op Voltage: 25V  [CER0402]  (hidden comment: 1nF)
C307  Case/Package: 0402  Op Voltage: 25V  [CER0402]  (hidden comment: 1nF)
C308  Case/Package: 0402  Op Voltage: 25V  [CER0402]  (hidden comment: 1nF)
C309  Case/Package: 0402  Op Voltage: 50V  [CER0402]  (hidden comment: 1.5nF)
C310  Case/Package: 0402  Op Voltage: 50V  [CER0402]  (hidden comment: 1.5nF)
C311  Case/Package: 0402  Op Voltage: 50V  [CER0402]  (hidden comment: 1.5nF)
C312  Case/Package: 0402  Op Voltage: 50V  [CER0402]  (hidden comment: 1.5nF)
C313  Case/Package: 0402  Op Voltage: 50V  [CER0402]  (hidden comment: 470pF)
C314  Case/Package: 0402  Op Voltage: 50V  [CER0402]  (hidden comment: 470pF)
C315  Case/Package: 0402  Op Voltage: 50V  [CER0402]  (hidden comment: 470pF)
C316  Case/Package: 0402  Op Voltage: 50V  [CER0402]  (hidden comment: 470pF)
FB300  Impedence @100MHz: 600R  Rated Current @85°C: 0.8A  [FEB0603]
R300  value 0R  Tolerance: 0%  Case/Package: 0402  [Res0402]  (hidden comment: SMD Resistor)
R301  value 100R  Tolerance: 1%  Case/Package: 0402  [Res0402]  (hidden comment: SMD Resistor)
R302  value 0R  Tolerance: 0%  Case/Package: 0402  [Res0402]  (hidden comment: SMD Resistor)
R303  value 100R  Tolerance: 1%  Case/Package: 0402  [Res0402]  (hidden comment: SMD Resistor)
R304  value 0R  Tolerance: 0%  Case/Package: 0402  [Res0402]  (hidden comment: SMD Resistor)
R305  value 0R  Tolerance: 0%  Case/Package: 0402  [Res0402]  (hidden comment: SMD Resistor)
R306  value 100R  Tolerance: 1%  Case/Package: 0402  [Res0402]  (hidden comment: SMD Resistor)
R307  value 100R  Tolerance: 1%  Case/Package: 0402  [Res0402]  (hidden comment: SMD Resistor)
R308  value 1K  Tolerance: 1%  Case/Package: 0402  [Res0402]  (hidden comment: SMD Resistor)
R309  value 1K  Tolerance: 1%  Case/Package: 0402  [Res0402]  (hidden comment: SMD Resistor)
U300  LDC5072EPWRQ1  value LDC5072  [TSSOP16-PW_TEX]

### Ports
COS_N, COS_P, RX_COS_N, RX_COS_P, RX_SIN_N, RX_SIN_P, SIN_N, SIN_P, TX_N, TX_P

### Nets
3V3: FB300.1
3V3_LDC: C300.1 C301.1 C302.1 FB300.2 R308.2 U300.14(VREG) U300.16(VCC)
GND: C300.2 C301.2 C302.2 C305.2 C306.2 C307.2 C308.2 C309.2 C310.2 C311.2 C312.2 C313.2 C314.2 C315.2 C316.2 R309.1 U300.3(TM0) U300.9(TOUT) U300.15(GND)
AGC_EN: R308.1 R309.2 U300.8(AGC_EN)
COS_FILT_N: C303.1 C306.1 R302.2 ; port COS_N
COS_FILT_P: C303.2 C305.1 R300.2 ; port COS_P
COS_N: R302.1 U300.12(OUT0N)
COS_P: R300.1 U300.13(OUT0P)
RX_COS_FILT_N: C314.1 R303.2 U300.6(IN0N)
RX_COS_FILT_P: C313.1 R301.2 U300.4(IN0P)
RX_COS_N: R303.1 ; port RX_COS_N
RX_COS_P: R301.1 ; port RX_COS_P
RX_SIN_FILT_N: C316.1 R307.2 U300.7(IN1N)
RX_SIN_FILT_P: C315.1 R306.2 U300.5(IN1P)
RX_SIN_N: R307.1 ; port RX_SIN_N
RX_SIN_P: R306.1 ; port RX_SIN_P
SIN_FILT_N: C304.1 C308.1 R305.2 ; port SIN_N
SIN_FILT_P: C304.2 C307.1 R304.2 ; port SIN_P
SIN_N: R305.1 U300.10(OUT1N)
SIN_P: R304.1 U300.11(OUT1P)
TX_N: C311.1 C312.1 U300.2(LCOUT) ; port TX_N
TX_P: C309.1 C310.1 U300.1(LCIN) ; port TX_P

### Layout directives
differential pair: COS_FILT_N, COS_FILT_P, COS_N, COS_P, RX_COS_FILT_N, RX_COS_FILT_P, RX_SIN_FILT_N, RX_SIN_FILT_P, SIN_FILT_N, SIN_FILT_P, SIN_N, SIN_P

### Notes on the sheet
- 1uF Near Vreg
- To be tuned with the TX coil inductance
- use C0G/NP0 insulator material
- To choose the gain of the analog front-end
- or leave it automatic (R8 DNM) if it is possible
- Proj
- Title:
- Approved:
- Sheet
- File Name:
- Rev:
- Author:
- Date:
- Size:
- A3
- Number:

### Library data of the parts
C300 C303 C304 = GCM155R71H104KE02D: as C204 on sheet pwr; MPN1: GCM155R71H104KE02D; Value: 100nF; MFG2: MURATA; MPN2: GCM155R71H104KE37; Tolerance: 10%; Dielectric: X7R; Supplier: Mouser; Supplier Part Number: 81-GCM155R71H104KE2D; Supplier URL: https://www.mouser.it/ProductDetail/Murata-Electronics/GCM155R71H104KE02D?qs=hNud%2FORuBR2sLZsqfoz4Fw%3D%3D; Datasheet URL: https://www.mouser.it/datasheet/2/281/1/GCM155R71H104KE02_01A-3142168.pdf; Technology: Powertrain/Safety for Automotive
C301 = GCM155R71H103KA55*: MLCC Automotive, 10nF, 0402, 25V, 10%, X7r; MFG1: MURATA; Min Op# Temp °C: -55; Max Op# temp °C: 125; Qualification: AEC-Q200; MPN1: GCM155R71H103KA55*; Value: 10nF; Tolerance: 10%; Dielectric: X7R; Supplier: Mouser; Supplier Part Number: 81-GCM155R71H103KA5J; Supplier URL: https://www.mouser.it/ProductDetail/Murata-Electronics/GCM155R71H103KA55J?qs=N3Kl9KD794RolAwdnyzU1Q%3D%3D; Datasheet URL: https://www.mouser.it/datasheet/2/281/1/GCM155R71H103KA55_01A-3142380.pdf; Technology: Powertrain/Safety for Automotive
C302 = GCM188R71C105KA64J: MLCC Automotive, 1uF, 0603, 16V, 10%, X7R; MFG1: MURATA; Min Op# Temp °C: -55; Max Op# temp °C: 125; Qualification: AEC-Q200; MPN1: GCM188R71C105KA64J; Value: 1uF; MFG2: KEMET; MPN2: C0603C105K4RACAUTO; Tolerance: 10%; Dielectric: X7R; Supplier: Mouser; Supplier Part Number: 81-GCM188R71C105KA4J; Supplier URL: https://www.mouser.it/ProductDetail/Murata-Electronics/GCM188R71C105KA64J?qs=4%252BGqC78dy0BN5WaW5TLgXw%3D%3D; Datasheet URL: https://www.mouser.it/datasheet/2/281/1/GCM188R71C105KA64_04A-3143889.pdf; Technology: Powertrain/Safety for Automotive
C305-C308 = GRT1555C1E102JA02J: MLCC Automotive, 1nF, 0402, 25V, 10%, COG; MFG1: MURATA; Tolerance: 5%; Dielectric: C0G; Min Op# Temp °C: -55; Max Op# temp °C: 125; Qualification: AEC-Q200; MPN1: GRT1555C1E102JA02J; Value: 1nF; Supplier: Mouser; Supplier Part Number: 81-GRT1555C1E102JA2J; Supplier URL: https://www.mouser.it/it/ProductDetail/Murata-Electronics/GRT1555C1E102JA02J?qs=sGAEpiMZZMvsSlwiRhF8qtsGU%2FCnaNeQokeRzBpVly3nnJVQ2ndM9w%3D%3D; Datasheet URL: https://www.mouser.it/datasheet/3/76/4/GRT1555C1E102JA02_01A.pdf
C309-C312 = C0402C152J5GECAUTO: MLCC Automotive, 1.5nF, 0402, 50V, 5%, COG; MFG1: KEMET; Min Op# Temp °C: -55; Max Op# temp °C: 125; Qualification: AEC-Q200; MPN1: C0402C152J5GECAUTO; Value: 1.5nF; Tolerance: 5%; Dielectric: COG; Supplier: Mouser; Supplier Part Number: 80-C0402C152J5GECAUT; Supplier URL: https://www.mouser.it/it/ProductDetail/KEMET/C0402C152J5GECAUTO?qs=sGAEpiMZZMvsSlwiRhF8qtsBU8Zhqm2RstfWlm%252B2k5Aa%2FmzJukmmdw%3D%3D
C313-C316 = GCM1555C1H471JA16: MLCC Automotive, 470pF, 0402, 50V, 5%, COG; MFG1: MURATA; Min Op# Temp °C: -55; Max Op# temp °C: 125; Qualification: AEC-Q200; MPN1: GCM1555C1H471JA16; Value: 470pF; Tolerance: 5%; Dielectric: COG; Supplier: Mouser; Supplier Part Number: 81-GCM1555C1H471JA6J; Supplier URL: https://www.mouser.it/ProductDetail/Murata-Electronics/GCM1555C1H471JA16J?qs=N3Kl9KD794TXvw4%2Fs7azFA%3D%3D; Technology: Powertrain/Safety for Automotive
FB300 = BLM18HE601SH1D: as FB400 on sheet mcu; MPN1: BLM18HE601SH1D; Impedence @1GHz: 600R; Case/Package: 0603; Supplier: Mouser; Supplier Part Number: 81-BLM18HE601SH1D; Supplier URL: https://www.mouser.it/ProductDetail/Murata-Electronics/BLM18HE601SH1D?qs=d0WKAl%252BL4KZJDOgHon8ecQ%3D%3D; Datasheet URL: https://www.murata.com/products/productdata/8796199452702/QNFA9104.pdf?1539737628000; Max Op# temp °C: 125; Technology: AEC-Q200
R300 R302 R304 R305 = CRCW04020000Z0ED: Thick Film SM Chip Resistors, 0R, 0402, 1/16W; MFG1: VISHAY; Power: 63mW; Temp# Coeffiient (PPM/C): 0; Min Op# Temp °C: -55; Max Op# temp °C: 155; Qualification: AEC-Q200; MPN1: CRCW04020000Z0ED; Supplier: Mouser; Supplier Part Number: 71-CRCW0402-0-E3; Supplier URL: https://www.mouser.it/ProductDetail/Vishay-Dale/CRCW04020000Z0ED?qs=OlqPY1Ciranv3qgeAHCodg%3D%3D; Datasheet URL: https://www.vishay.com/docs/20035/dcrcwe3.pdf; Technology: Thick Film
R301 R303 R306 R307 = CRCW0402100RFKED: Thick Film SM Chip Resistors, 100R, 0402, ±1%, 1/16W; MFG1: VISHAY; Power: 63mW; Temp# Coeffiient (PPM/C): 100; Min Op# Temp °C: -55; Max Op# temp °C: 155; Qualification: AEC-Q200; MPN1: CRCW0402100RFKED; Supplier: Mouser; Supplier Part Number: 71-CRCW0402-100-E3; Supplier URL: https://www.mouser.it/ProductDetail/Vishay-Dale/CRCW0402100RFKED?qs=OlqPY1CiralT1EG%2F62gJpQ%3D%3D; Datasheet URL: https://www.vishay.com/docs/20035/dcrcwe3.pdf; Technology: Thick Film
R308 R309 = CRCW04021K00FKED: Thick Film SM Chip Resistors, 1K, 0402, ±1%, 1/16W; MFG1: VISHAY; Power: 63mW; Temp# Coeffiient (PPM/C): 100; Min Op# Temp °C: -55; Max Op# temp °C: 155; Qualification: AEC-Q200; MPN1: CRCW04021K00FKED; Supplier: Mouser; Supplier Part Number: 71-CRCW0402-1.0K-E3; Supplier URL: https://www.mouser.it/ProductDetail/Vishay-Dale/CRCW04021K00FKED?qs=YX%252BK5oaHNYqQ2WK%252BIAW12A%3D%3D; Technology: Thick Film
U300 = LDC5072EPWRQ1: IPS interface IC; Manufacturer_Name: Texas Instruments; MFG1: TI; Min Op# Temp °C: -40; Max Op# temp °C: 160; Qualification: AEC-Q100; Type: Specialized Sensors; Copyright: Copyright (C) 2026 Ultra Librarian. All rights reserved.; Manufacturer_Part_Number: LDC5072EPWRQ1; RefDes: RefDes; MPN1: LDC5072EPWRQ1; Case/Package: TSSOP-16; Supplier: Mouser; Supplier Part Number: 595-LDC5072EPWRQ1; Supplier URL: https://www.mouser.it/it/ProductDetail/Texas-Instruments/LDC5072EPWRQ1?qs=GBLSl2AkiruyHDEJhswGzQ%3D%3D; Datasheet URL: https://www.ti.com/lit/ds/symlink/ldc5072-q1.pdf?ts=1784869376494&ref_url=https%253A%252F%252Fwww.ti.com%252Fproduct%252FLDC5072-Q1

## Nets that join several sheets
3V3: pwr (C207.1 R201.2 U201.1), mcu (D400.2 FB400.1), coil_if (FB300.1)
Buck_Vin: pwr (6 pins), mcu (R406.2)
GND: Bucaneve_single_board (TP101.1), pwr (16 pins), out_drv (6 pins), mcu (16 pins), coil_if (19 pins)
V_SUPPLY: Bucaneve_single_board (TP100.1), pwr (F200.1)
COS_FILT_N: mcu (U400.6), coil_if (C303.1 C306.1 R302.2)
COS_FILT_P: mcu (U400.5), coil_if (C303.2 C305.1 R300.2)
INT_A: out_drv (R500.1), mcu (U400.21 U400.28)
INT_B: out_drv (R501.1), mcu (U400.22 U400.27)
OUT_A: Bucaneve_single_board (TP102.1), out_drv (C500.1 D500.1 F500.2)
OUT_B: Bucaneve_single_board (TP103.1), out_drv (C501.1 D501.1 F501.2)
RX_COS_N: Bucaneve_single_board (A100.4), coil_if (R303.1)
RX_COS_P: Bucaneve_single_board (A100.3), coil_if (R301.1)
RX_SIN_N: Bucaneve_single_board (A100.6), coil_if (R307.1)
RX_SIN_P: Bucaneve_single_board (A100.5), coil_if (R306.1)
SIN_FILT_N: mcu (U400.12), coil_if (C304.1 C308.1 R305.2)
SIN_FILT_P: mcu (U400.11), coil_if (C304.2 C307.1 R304.2)
TX_N: Bucaneve_single_board (A100.2), coil_if (C311.1 C312.1 U300.2)
TX_P: Bucaneve_single_board (A100.1), coil_if (C309.1 C310.1 U300.1)

## Assembly variants
Base: not fitted C? C? C? C? R400 R404